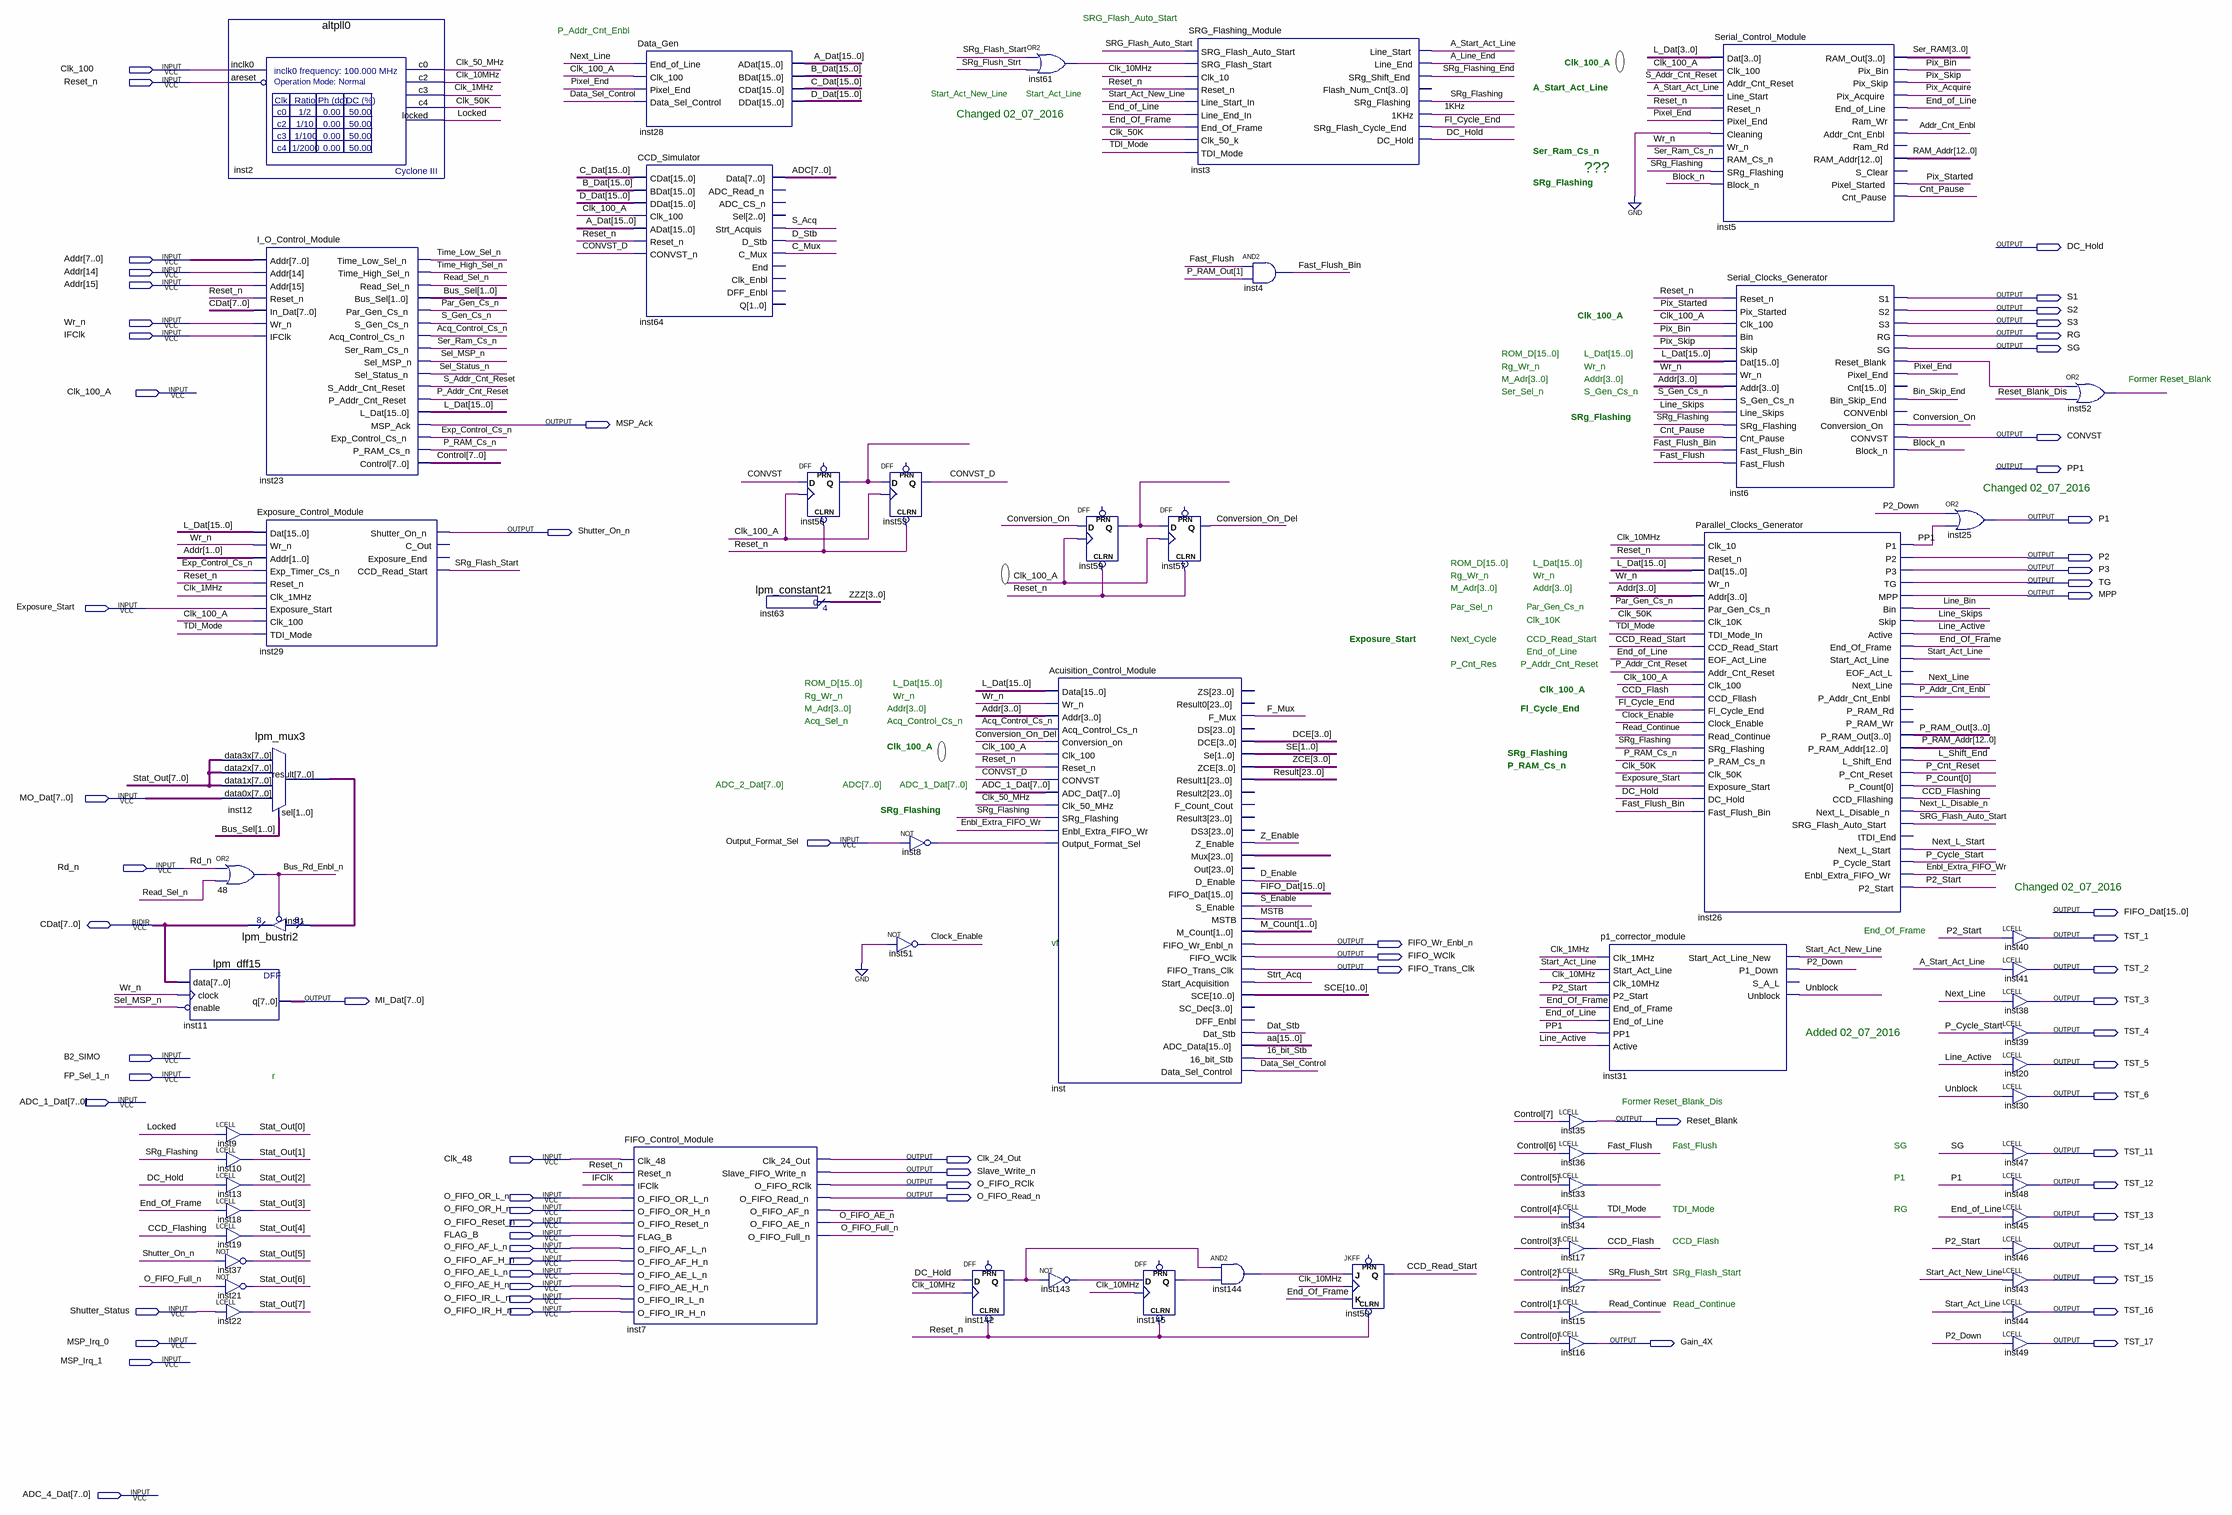
[diagram p0: schematic sheet]
// Quartus schematic Main.bdf as structural Verilog: 61 symbols, 70 pins
module Main (
  input  Clk_100,
  input  Reset_n,
  input  [15:0] Addr,
  input  Wr_n,
  input  IFClk,
  input  Clk_100_A,
  input  Exposure_Start,
  input  [7:0] MO_Dat,
  input  Output_Format_Sel,
  input  Rd_n,
  input  B2_SIMO,
  input  FP_Sel_1_n,
  input  [7:0] ADC_1_Dat,
  input  Clk_48,
  input  O_FIFO_OR_L_n,
  input  O_FIFO_OR_H_n,
  input  O_FIFO_Reset_n,
  input  FLAG_B,
  input  O_FIFO_AF_L_n,
  input  O_FIFO_AF_H_n,
  input  O_FIFO_AE_L_n,
  input  O_FIFO_AE_H_n,
  input  O_FIFO_IR_L_n,
  input  Shutter_Status,
  input  O_FIFO_IR_H_n,
  input  MSP_Irq_0,
  input  MSP_Irq_1,
  input  [7:0] ADC_4_Dat,
  inout  [7:0] CDat,
  output DC_Hold,
  output S1,
  output S2,
  output S3,
  output RG,
  output SG,
  output MSP_Ack,
  output CONVST,
  output PP1,
  output P1,
  output Shutter_On_n,
  output P2,
  output P3,
  output TG,
  output MPP,
  output [15:0] FIFO_Dat,
  output TST_1,
  output FIFO_Wr_Enbl_n,
  output FIFO_WClk,
  output FIFO_Trans_Clk,
  output TST_2,
  output [7:0] MI_Dat,
  output TST_3,
  output TST_4,
  output TST_5,
  output TST_6,
  output Reset_Blank,
  output TST_11,
  output Clk_24_Out,
  output Slave_Write_n,
  output O_FIFO_RClk,
  output TST_12,
  output O_FIFO_Read_n,
  output TST_13,
  output TST_14,
  output TST_15,
  output TST_16,
  output Gain_4X,
  output TST_17
);

  wire \1KHz , \16_bit_Stb , A_Line_End, A_Start_Act_Line, Acq_Control_Cs_n, Addr_Cnt_Enbl, Bin_Skip_End,
       Block_n, Bus_Rd_Enbl_n, C_Mux, CCD_Flash, CCD_Flashing, CCD_Read_Start, Clk_1MHz, Clk_10MHz,
       Clk_50_MHz, Clk_50K, Clock_Enable, Cnt_Pause, Conversion_On, Conversion_On_Del, CONVST_D, D_Enable,
       D_Stb, Dat_Stb, Data_Sel_Control, Enbl_Extra_FIFO_Wr, End_Of_Frame, End_of_Line, Exp_Control_Cs_n,
       F_Mux, Fast_Flush, Fast_Flush_Bin, Fl_Cycle_End, inst6_reset_blank, inst7_o_fifo_af_n, inst8_out,
       inst33_out, inst52_out, inst56_q, inst59_q, inst61_out, inst142_q, inst143_out, inst144_out,
       inst145_q, L_Shift_End, Line_Active, Line_Bin, Line_Skips, Locked, MSTB, Next_L_Disable_n,
       Next_L_Start, Next_Line, O_FIFO_AE_n, O_FIFO_Full_n, P2_Down, P2_Start, P_Addr_Cnt_Enbl,
       P_Addr_Cnt_Reset, P_Cnt_Reset, P_Cycle_Start, P_RAM_Cs_n, Par_Gen_Cs_n, Pix_Acquire, Pix_Bin,
       Pix_Skip, Pix_Started, Pixel_End, Read_Continue, Read_Sel_n, Reset_Blank_Dis, S_Acq, S_Addr_Cnt_Reset,
       S_Enable, S_Gen_Cs_n, Sel_MSP_n, Sel_Status_n, Ser_Ram_Cs_n, SRG_Flash_Auto_Start, SRg_Flash_Start,
       SRg_Flashing, SRg_Flashing_End, SRg_Flush_Strt, Start_Act_Line, Start_Act_New_Line, Strt_Acq,
       TDI_Mode, Time_High_Sel_n, Time_Low_Sel_n, Unblock, Z_Enable;
  wire [0:0] P_Count;
  wire [1:0] Bus_Sel, M_Count, SE;
  wire [3:0] DCE, P_RAM_Out, Ser_RAM, ZCE, ZZZ;
  wire [7:0] ADC, Control, inst12_result, Stat_Out;
  wire [10:0] SCE;
  wire [12:0] P_RAM_Addr, RAM_Addr;
  wire [15:0] A_Dat, aa, B_Dat, C_Dat, D_Dat, L_Dat;
  wire [23:0] inst_mux, Result;

  lpm_dff15 inst11 (.data(CDat), .clock(Wr_n), .enable(~Sel_MSP_n), .q(MI_Dat));
  altpll0 inst2 (
    .inclk0(Clk_100), .areset(~Reset_n), .c0(Clk_50_MHz), .c2(Clk_10MHz), .c3(Clk_1MHz), .c4(Clk_50K),
    .locked(Locked));
  I_O_Control_Module inst23 (
    .Addr({Addr[15:14], Addr[7:0]}), .Reset_n(Reset_n), .In_Dat(CDat), .Wr_n(Wr_n), .IFClk(IFClk),
    .Time_Low_Sel_n(Time_Low_Sel_n), .Time_High_Sel_n(Time_High_Sel_n), .Read_Sel_n(Read_Sel_n),
    .Bus_Sel(Bus_Sel), .Par_Gen_Cs_n(Par_Gen_Cs_n), .S_Gen_Cs_n(S_Gen_Cs_n),
    .Acq_Control_Cs_n(Acq_Control_Cs_n), .Ser_Ram_Cs_n(Ser_Ram_Cs_n), .Sel_MSP_n(Sel_MSP_n),
    .Sel_Status_n(Sel_Status_n), .S_Addr_Cnt_Reset(S_Addr_Cnt_Reset), .P_Addr_Cnt_Reset(P_Addr_Cnt_Reset),
    .L_Dat(L_Dat), .MSP_Ack(MSP_Ack), .Exp_Control_Cs_n(Exp_Control_Cs_n), .P_RAM_Cs_n(P_RAM_Cs_n),
    .Control(Control));
  Exposure_Control_Module inst29 (
    .Dat(L_Dat), .Wr_n(Wr_n), .Addr(Addr[1:0]), .Exp_Timer_Cs_n(Exp_Control_Cs_n), .Reset_n(Reset_n),
    .Clk_1MHz(Clk_1MHz), .Exposure_Start(Exposure_Start), .Clk_100(Clk_100_A), .TDI_Mode(TDI_Mode),
    .Shutter_On_n(Shutter_On_n), .CCD_Read_Start(SRg_Flash_Start));  // open: C_Out, Exposure_End
  lpm_mux3 inst12 (
    .data3x(Stat_Out), .data2x(Stat_Out), .data1x(Stat_Out), .data0x(MO_Dat), .sel(Bus_Sel),
    .result(inst12_result));
  or u_48 (Bus_Rd_Enbl_n, Rd_n, Read_Sel_n);
  lpm_bustri2 inst1 (.enabledt(~Bus_Rd_Enbl_n), .data(inst12_result), .tridata(CDat));
  LCELL inst9 (.IN(Locked), .OUT(Stat_Out[0]));
  LCELL inst10 (.IN(SRg_Flashing), .OUT(Stat_Out[1]));
  LCELL inst13 (.IN(DC_Hold), .OUT(Stat_Out[2]));
  LCELL inst18 (.IN(End_Of_Frame), .OUT(Stat_Out[3]));
  LCELL inst19 (.IN(CCD_Flashing), .OUT(Stat_Out[4]));
  not inst37 (Stat_Out[5], Shutter_On_n);
  not inst21 (Stat_Out[6], O_FIFO_Full_n);
  LCELL inst22 (.IN(Shutter_Status), .OUT(Stat_Out[7]));
  Data_Gen inst28 (
    .End_of_Line(Next_Line), .Clk_100(Clk_100_A), .Pixel_End(Pixel_End), .Data_Sel_Control(Data_Sel_Control),
    .ADat(A_Dat), .BDat(B_Dat), .CDat(C_Dat), .DDat(D_Dat));
  CCD_Simulator inst64 (
    .CDat(C_Dat), .BDat(B_Dat), .DDat(D_Dat), .Clk_100(Clk_100_A), .ADat(A_Dat), .Reset_n(Reset_n),
    .CONVST_n(CONVST_D), .Data(ADC), .Strt_Acquis(S_Acq), .D_Stb(D_Stb), .C_Mux(C_Mux));  // open: ADC_Read_n, ADC_CS_n, Sel, End, Clk_Enbl, DFF_Enbl, Q
  FIFO_Control_Module inst7 (
    .Clk_48(Clk_48), .Reset_n(Reset_n), .IFClk(IFClk), .O_FIFO_OR_L_n(O_FIFO_OR_L_n),
    .O_FIFO_OR_H_n(O_FIFO_OR_H_n), .O_FIFO_Reset_n(O_FIFO_Reset_n), .FLAG_B(FLAG_B),
    .O_FIFO_AF_L_n(O_FIFO_AF_L_n), .O_FIFO_AF_H_n(O_FIFO_AF_H_n), .O_FIFO_AE_L_n(O_FIFO_AE_L_n),
    .O_FIFO_AE_H_n(O_FIFO_AE_H_n), .O_FIFO_IR_L_n(O_FIFO_IR_L_n), .O_FIFO_IR_H_n(O_FIFO_IR_H_n),
    .Clk_24_Out(Clk_24_Out), .Slave_FIFO_Write_n(Slave_Write_n), .O_FIFO_RClk(O_FIFO_RClk),
    .O_FIFO_Read_n(O_FIFO_Read_n), .O_FIFO_AF_n(inst7_o_fifo_af_n), .O_FIFO_AE_n(O_FIFO_AE_n),
    .O_FIFO_Full_n(O_FIFO_Full_n));
  lpm_constant21 inst63 (.result(ZZZ));
  DFF inst56 (.CLRN(Reset_n), .CLK(Clk_100_A), .D(CONVST), .Q(inst56_q));  // open: PRN
  DFF inst53 (.CLRN(Reset_n), .CLK(Clk_100_A), .D(inst56_q), .Q(CONVST_D));  // open: PRN
  not inst8 (inst8_out, Output_Format_Sel);
  not inst51 (Clock_Enable, 1'b0);
  DFF inst142 (.CLRN(Reset_n), .CLK(Clk_10MHz), .D(DC_Hold), .Q(inst142_q));  // open: PRN
  or inst61 (inst61_out, SRg_Flash_Start, SRg_Flush_Strt);
  Acuisition_Control_Module inst (
    .Data(L_Dat), .Wr_n(Wr_n), .Addr(Addr[3:0]), .Acq_Control_Cs_n(Acq_Control_Cs_n),
    .Conversion_on(Conversion_On_Del), .Clk_100(Clk_100_A), .Reset_n(Reset_n), .CONVST(CONVST_D),
    .ADC_Dat(ADC_1_Dat), .Clk_50_MHz(Clk_50_MHz), .SRg_Flashing(SRg_Flashing),
    .Enbl_Extra_FIFO_Wr(Enbl_Extra_FIFO_Wr), .Output_Format_Sel(inst8_out), .F_Mux(F_Mux), .DCE(DCE),
    .Se(SE), .ZCE(ZCE), .Result1(Result), .Z_Enable(Z_Enable), .Mux(inst_mux), .D_Enable(D_Enable),
    .FIFO_Dat(FIFO_Dat), .S_Enable(S_Enable), .MSTB(MSTB), .M_Count(M_Count),
    .FIFO_Wr_Enbl_n(FIFO_Wr_Enbl_n), .FIFO_WClk(FIFO_WClk), .FIFO_Trans_Clk(FIFO_Trans_Clk),
    .Start_Acquisition(Strt_Acq), .SCE(SCE), .Dat_Stb(Dat_Stb), .ADC_Data(aa), .\16_bit_Stb (\16_bit_Stb ),
    .Data_Sel_Control(Data_Sel_Control));  // open: ZS, Result0, DS, Result2, F_Count_Cout, Result3, DS3, Out, SC_Dec, DFF_Enbl
  not inst143 (inst143_out, inst142_q);
  DFF inst59 (.CLRN(Reset_n), .CLK(Clk_100_A), .D(Conversion_On), .Q(inst59_q));  // open: PRN
  DFF inst57 (.CLRN(Reset_n), .CLK(Clk_100_A), .D(inst59_q), .Q(Conversion_On_Del));  // open: PRN
  DFF inst145 (.CLRN(Reset_n), .CLK(Clk_10MHz), .D(inst143_out), .Q(inst145_q));  // open: PRN
  SRG_Flashing_Module inst3 (
    .SRG_Flash_Auto_Start(SRG_Flash_Auto_Start), .SRG_Flash_Start(inst61_out), .Clk_10(Clk_10MHz),
    .Reset_n(Reset_n), .Line_Start_In(Start_Act_New_Line), .Line_End_In(End_of_Line),
    .End_Of_Frame(End_Of_Frame), .Clk_50_k(Clk_50K), .TDI_Mode(TDI_Mode), .Line_Start(A_Start_Act_Line),
    .Line_End(A_Line_End), .SRg_Shift_End(SRg_Flashing_End), .SRg_Flashing(SRg_Flashing), .\1KHz (\1KHz ),
    .SRg_Flash_Cycle_End(Fl_Cycle_End), .DC_Hold(DC_Hold));  // open: Flash_Num_Cnt
  and inst144 (inst144_out, inst142_q, inst145_q);
  and inst4 (Fast_Flush_Bin, Fast_Flush, P_RAM_Out[1]);
  JKFF inst50 (.CLRN(Reset_n), .K(End_Of_Frame), .J(inst144_out), .CLK(Clk_10MHz), .Q(CCD_Read_Start));  // open: PRN
  LCELL inst35 (.IN(Control[7]), .OUT(Reset_Blank));
  LCELL inst36 (.IN(Control[6]), .OUT(Fast_Flush));
  LCELL inst33 (.IN(Control[5]), .OUT(inst33_out));
  LCELL inst34 (.IN(Control[4]), .OUT(TDI_Mode));
  LCELL inst17 (.IN(Control[3]), .OUT(CCD_Flash));
  LCELL inst27 (.IN(Control[2]), .OUT(SRg_Flush_Strt));
  LCELL inst15 (.IN(Control[1]), .OUT(Read_Continue));
  LCELL inst16 (.IN(Control[0]), .OUT(Gain_4X));
  p1_corrector_module inst31 (
    .Clk_1MHz(Clk_1MHz), .Start_Act_Line(Start_Act_Line), .Clk_10MHz(Clk_10MHz), .P2_Start(P2_Start),
    .End_of_Frame(End_Of_Frame), .End_of_Line(End_of_Line), .PP1(PP1), .Active(Line_Active),
    .Start_Act_Line_New(Start_Act_New_Line), .P1_Down(P2_Down), .Unblock(Unblock));  // open: S_A_L
  Serial_Control_Module inst5 (
    .Dat(L_Dat[3:0]), .Clk_100(Clk_100_A), .Addr_Cnt_Reset(S_Addr_Cnt_Reset), .Line_Start(A_Start_Act_Line),
    .Reset_n(Reset_n), .Pixel_End(Pixel_End), .Cleaning(1'b0), .Wr_n(Wr_n), .RAM_Cs_n(Ser_Ram_Cs_n),
    .SRg_Flashing(SRg_Flashing), .Block_n(Block_n), .RAM_Out(Ser_RAM), .Pix_Bin(Pix_Bin),
    .Pix_Skip(Pix_Skip), .Pix_Acquire(Pix_Acquire), .End_of_Line(End_of_Line), .Addr_Cnt_Enbl(Addr_Cnt_Enbl),
    .RAM_Addr(RAM_Addr), .Pixel_Started(Pix_Started), .Cnt_Pause(Cnt_Pause));  // open: Ram_Wr, Ram_Rd, S_Clear
  Serial_Clocks_Generator inst6 (
    .Reset_n(Reset_n), .Pix_Started(Pix_Started), .Clk_100(Clk_100_A), .Bin(Pix_Bin), .Skip(Pix_Skip),
    .Dat(L_Dat), .Wr_n(Wr_n), .Addr(Addr[3:0]), .S_Gen_Cs_n(S_Gen_Cs_n), .Line_Skips(Line_Skips),
    .SRg_Flashing(SRg_Flashing), .Cnt_Pause(Cnt_Pause), .Fast_Flush_Bin(Fast_Flush_Bin),
    .Fast_Flush(Fast_Flush), .S1(S1), .S2(S2), .S3(S3), .RG(RG), .SG(SG), .Reset_Blank(inst6_reset_blank),
    .Pixel_End(Pixel_End), .Bin_Skip_End(Bin_Skip_End), .Conversion_On(Conversion_On), .CONVST(CONVST),
    .Block_n(Block_n));  // open: Cnt, CONVEnbl
  Parallel_Clocks_Generator inst26 (
    .Clk_10(Clk_10MHz), .Reset_n(Reset_n), .Dat(L_Dat), .Wr_n(Wr_n), .Addr(Addr[3:0]),
    .Par_Gen_Cs_n(Par_Gen_Cs_n), .Clk_10K(Clk_50K), .TDI_Mode_In(TDI_Mode), .CCD_Read_Start(CCD_Read_Start),
    .EOF_Act_Line(End_of_Line), .Addr_Cnt_Reset(P_Addr_Cnt_Reset), .Clk_100(Clk_100_A),
    .CCD_Fllash(CCD_Flash), .Fl_Cycle_End(Fl_Cycle_End), .Clock_Enable(Clock_Enable),
    .Read_Continue(Read_Continue), .SRg_Flashing(SRg_Flashing), .P_RAM_Cs_n(P_RAM_Cs_n), .Clk_50K(Clk_50K),
    .Exposure_Start(Exposure_Start), .DC_Hold(DC_Hold), .Fast_Flush_Bin(Fast_Flush_Bin), .P1(PP1), .P2(P2),
    .P3(P3), .TG(TG), .MPP(MPP), .Bin(Line_Bin), .Skip(Line_Skips), .Active(Line_Active),
    .End_Of_Frame(End_Of_Frame), .Start_Act_Line(Start_Act_Line), .Next_Line(Next_Line),
    .P_Addr_Cnt_Enbl(P_Addr_Cnt_Enbl), .P_RAM_Out(P_RAM_Out), .P_RAM_Addr(P_RAM_Addr),
    .L_Shift_End(L_Shift_End), .P_Cnt_Reset(P_Cnt_Reset), .P_Count(P_Count[0]), .CCD_Fllashing(CCD_Flashing),
    .Next_L_Disable_n(Next_L_Disable_n), .SRG_Flash_Auto_Start(SRG_Flash_Auto_Start),
    .Next_L_Start(Next_L_Start), .P_Cycle_Start(P_Cycle_Start), .Enbl_Extra_FIFO_Wr(Enbl_Extra_FIFO_Wr),
    .P2_Start(P2_Start));  // open: EOF_Act_L, P_RAM_Rd, P_RAM_Wr, tTDI_End
  or inst25 (P1, P2_Down, PP1);
  LCELL inst40 (.IN(P2_Start), .OUT(TST_1));
  LCELL inst41 (.IN(A_Start_Act_Line), .OUT(TST_2));
  LCELL inst38 (.IN(Next_Line), .OUT(TST_3));
  LCELL inst39 (.IN(P_Cycle_Start), .OUT(TST_4));
  LCELL inst20 (.IN(Line_Active), .OUT(TST_5));
  LCELL inst30 (.IN(Unblock), .OUT(TST_6));
  LCELL inst47 (.IN(SG), .OUT(TST_11));
  LCELL inst48 (.IN(P1), .OUT(TST_12));
  LCELL inst45 (.IN(End_of_Line), .OUT(TST_13));
  LCELL inst46 (.IN(P2_Start), .OUT(TST_14));
  LCELL inst43 (.IN(Start_Act_New_Line), .OUT(TST_15));
  LCELL inst44 (.IN(Start_Act_Line), .OUT(TST_16));
  LCELL inst49 (.IN(P2_Down), .OUT(TST_17));
  or inst52 (inst52_out, inst6_reset_blank, Reset_Blank_Dis);

  // Notes on the sheet:
  //   SRG_Flash_Auto_Start
  //   P_Addr_Cnt_Enbl
  //   Clk_100_A
  //   A_Start_Act_Line
  //   Start_Act_New_Line
  //   Start_Act_Line
  //   Changed 02_07_2016
  //   Ser_Ram_Cs_n
  //   ???
  //   SRg_Flashing
  //   Clk_100_A
  //   ROM_D[15..0]
  //   L_Dat[15..0]
  //   Rg_Wr_n
  //   Wr_n
  //   M_Adr[3..0]
  //   Addr[3..0]
  //   Former Reset_Blank
  //   Ser_Sel_n
  //   S_Gen_Cs_n
  //   SRg_Flashing
  //   Changed 02_07_2016
  //   ROM_D[15..0]
  //   L_Dat[15..0]
  //   Rg_Wr_n
  //   Wr_n
  //   M_Adr[3..0]
  //   Addr[3..0]
  //   Par_Sel_n
  //   Par_Gen_Cs_n
  //   Clk_10K
  //   Exposure_Start
  //   Next_Cycle
  //   CCD_Read_Start
  //   End_of_Line
  //   P_Cnt_Res
  //   P_Addr_Cnt_Reset
  //   ROM_D[15..0]
  //   L_Dat[15..0]
  //   Clk_100_A
  //   Rg_Wr_n
  //   Wr_n
  //   M_Adr[3..0]
  //   Addr[3..0]
  //   Fl_Cycle_End
  //   Acq_Sel_n
  //   Acq_Control_Cs_n
  //   Clk_100_A
  //   SRg_Flashing
  //   P_RAM_Cs_n
  //   ADC_2_Dat[7..0]
  //   ADC[7..0]
  //   ADC_1_Dat[7..0]
  //   SRg_Flashing
  //   Changed 02_07_2016
  //   End_Of_Frame
  //   vf
  //   Added 02_07_2016
  //   r
  //   Former Reset_Blank_Dis
  //   Fast_Flush
  //   SG
  //   P1
  //   TDI_Mode
  //   RG
  //   CCD_Flash
  //   SRg_Flash_Start
  //   Read_Continue
endmodule
